# EAGLE design xiaokey (EAGLE 9.6.2)
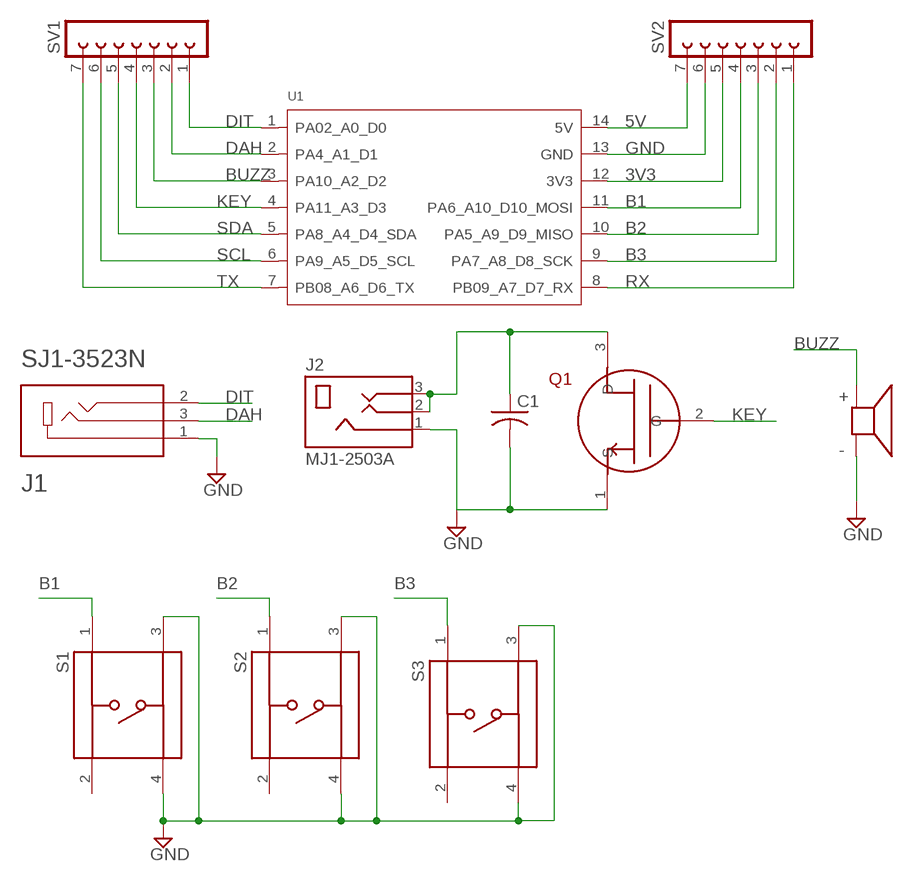
[diagram p0: schematic, sheet 1]

## Parts
C1  C-US050-024X044  [C050-024X044]
J1  SJ1-3523N  [CUI_SJ1-3523N]
J2  MJ1-2503A  [CUI_MJ1-2503A]
LS1  AT-0927-TT-6-R  [XDCR_AT-0927-TT-6-R]
Q1  2N7000  [TO92-LINE]
S1  TS02-66-60-BK-160-LCR-D  [SW_TS02-66-60-BK-160-LCR-D]
S2  TS02-66-60-BK-160-LCR-D  [SW_TS02-66-60-BK-160-LCR-D]
S3  TS02-66-60-BK-160-LCR-D  [SW_TS02-66-60-BK-160-LCR-D]
SV1  FE07-1  [FE07]
SV2  FE07-1  [FE07]
U1  MOUDLE-SEEEDUINO-XIAO  [MOUDLE14P-2.54-21X17.8MM]

## Nets
3V3: SV2.5 U1.12(3V3)
5V: SV2.7 U1.14(5V)
B1: S1.1 SV2.4 U1.11(PA6_A10_D10_MOSI)
B2: S2.1 SV2.3 U1.10(PA5_A9_D9_MISO)
B3: S3.1 SV2.2 U1.9(PA7_A8_D8_SCK)
BUZZ: LS1.P SV1.3 U1.3(PA10_A2_D2)
DAH: J1.3 SV1.2 U1.2(PA4_A1_D1)
DIT: J1.2 SV1.1 U1.1(PA02_A0_D0)
GND: C1.2 J1.1 J2.1 LS1.N Q1.1(S) S1.3 S1.4 S2.3 S2.4 S3.3 S3.4 SV2.6 U1.13(GND)
KEY: Q1.2(G) SV1.4 U1.4(PA11_A3_D3)
N$1: C1.1 J2.2 J2.3 Q1.3(D)
RX: SV2.1 U1.8(PB09_A7_D7_RX)
SCL: SV1.6 U1.6(PA9_A5_D5_SCL)
SDA: SV1.5 U1.5(PA8_A4_D4_SDA)
TX: SV1.7 U1.7(PB08_A6_D6_TX)
Unconnected: S1.2 S2.2 S3.2

## Library data of the parts
C1 = rcl:C-US: CAPACITOR, American symbol; SPICEPREFIX: C
J1 = SJ1-3523N:SJ1-3523N: 3.5 mm Right-Angle Stereo Jack, 3 Pin PCB Mount, Non-Threaded Check availability <https://pricing.snapeda.com/parts/SJ1-3523N/CUI%20Devices/view-part?ref=eda>; AVAILABILITY: In Stock; CUI_PURCHASE_URL: https://www.cuidevices.com/product/interconnect/connectors/audio-connectors/jacks/sj1-352xn-series?utm_source=snapeda.com&utm_medium=referral&utm_campaign=snapedaBOM; DESCRIPTION: 3.5 mm, Stereo, Right Angle, Through Hole, 3 Conductors, 0~2 Internal Switches, Audio Jack Connector; MF: CUI Devices; MP: SJ1-3523N; PACKAGE: None; PRICE: None; PURCHASE-URL: https://pricing.snapeda.com/search/part/SJ1-3523N/?ref=eda
J2 = MJ1-2503A:MJ1-2503A: 2.5 mm, Mono, Right Angle, Through Hole, Audio Jack Connector Check availability <https://pricing.snapeda.com/parts/MJ1-2503A/CUI%20Devices/view-part?ref=eda>; AVAILABILITY: In Stock; CUI_PURCHASE_URL: https://www.cuidevices.com/product/interconnect/connectors/audio-connectors/jacks/mj1-2503a?utm_source=snapeda.com&utm_medium=referral&utm_campaign=snapedaBOM; DESCRIPTION: 2.5 mm, Mono, Right Angle, Through Hole, 2 Conductors, 0 Internal Switches, Audio Jack Connector; MF: CUI Devices; MP: MJ1-2503A; PACKAGE: None; PRICE: None; PURCHASE-URL: https://pricing.snapeda.com/search/part/MJ1-2503A/?ref=eda
LS1 = AT-0927-TT-6-R:AT-0927-TT-6-R: AUDIO TRANSDUCER 85 DB 1.5 V 2730 HZ Check availability <https://pricing.snapeda.com/parts/AT-0927-TT-6-R/PUI%20Audio%2C/view-part?ref=eda>; AVAILABILITY: In Stock; DESCRIPTION: AUDIO TRANSDUCER 85 DB 3 V 2730 HZ; MF: PUI Audio,; MP: AT-0927-TT-6-R; PACKAGE: None; PRICE: None; PURCHASE-URL: https://pricing.snapeda.com/search/part/AT-0927-TT-6-R/?ref=eda
Q1 = 2N7000:2N7000: N-Channel Small Signal MOSFET Check availability <https://pricing.snapeda.com/parts/2N7000/STMicroelectronics/view-part?ref=eda>; AVAILABILITY: In Stock; DESCRIPTION: N-Channel 60 V 350mA (Tc) 1W (Tc) Through Hole TO-92-3; MF: STMicroelectronics; MP: 2N7000; PACKAGE: TO-92 STMicroelectronics; PRICE: None
S1-S3 = TS02-66-60-BK-160-LCR-D:TS02-66-60-BK-160-LCR-D: Check availability <https://pricing.snapeda.com/parts/TS02-66-60-BK-160-LCR-D/CUI%20Devices/view-part?ref=eda>; AVAILABILITY: In Stock; CUI_PURCHASE_URL: https://www.cuidevices.com/product/switches/tactile-switches/ts02-series?utm_source=snapeda.com&utm_medium=referral&utm_campaign=snapedaBOM; DESCRIPTION: 6 x 6 mm, 6 mm Actuator Height, 160 gf, Black, Long Crimped, Through Hole, SPST, Tactile Switch; MF: CUI Devices; MP: TS02-66-60-BK-160-LCR-D; PACKAGE: None; PRICE: None; PURCHASE-URL: https://pricing.snapeda.com/search/part/TS02-66-60-BK-160-LCR-D/?ref=eda
SV1 SV2 = con-lsta:FE07-1: FEMALE HEADER; OC_FARNELL: unknown; OC_NEWARK: unknown
U1 = Seeeduino XIAO:MOUDLE-SEEEDUINO-XIAO

## Board
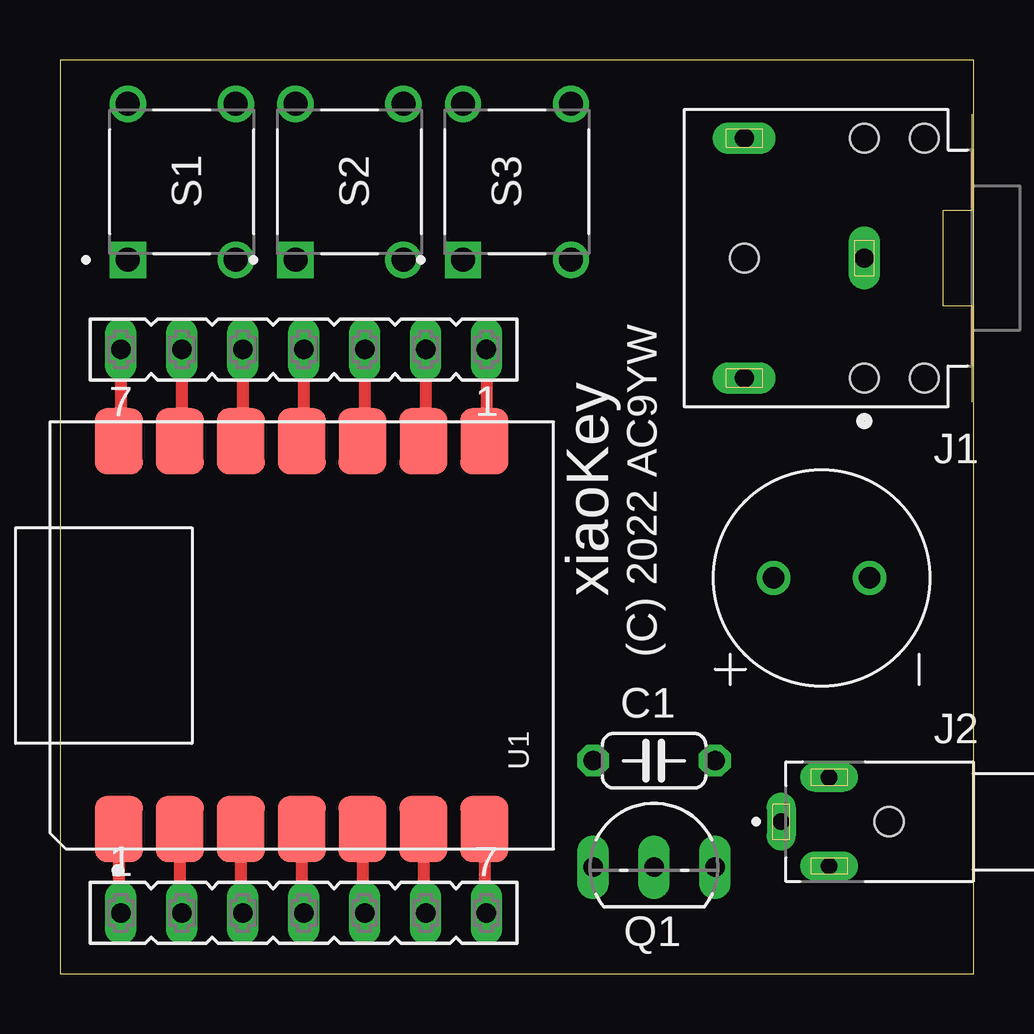
[diagram p1: board, top side]
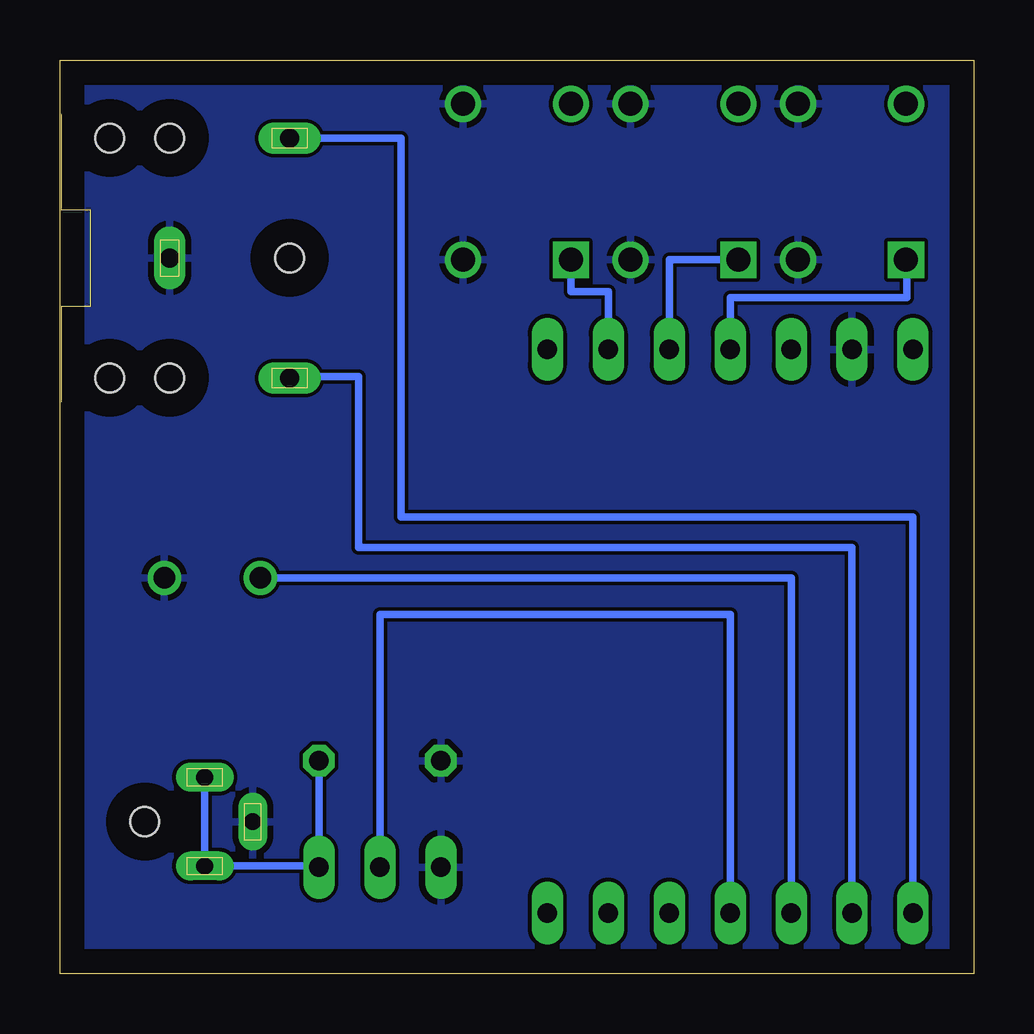
[diagram p2: board, bottom side, seen from below]

Size 38.1 x 38.1 mm. Coordinates in mm from the lower left corner, seen from the top.
Outline: 0,0 38.1,0 38.1,38.1 0,38.1 0,0
Copper layers (1*16): Top 0.035mm / dielectric 1.5mm / Bottom 0.035mm
Design rules "default": minimum track width 6mil, minimum drill 0.35mm, track to track 6mil, track to pad 6mil, pad to pad 6mil, via to via 6mil, smd to smd 6mil, copper to edge 40mil, drill to drill 6mil, minimum pad ring 10mil, minimum via ring 8mil, stop-mask expansion 4mil, vias tented up to drill 0mil, thermal gap 10mil

### Footprints (pad centres in the part's own frame; a part is rotated, then mirrored left to right if it is on the bottom)
C050-024X044 = drill 0.813 octagon: 1 -2.54,0; 2 2.54,0
CUI_SJ1-3523N = drill 0.8 long: 1 0,0; 2 5,-5; 3 5,5 | hole 1.2: -2.5,5; 0,5; 5,0; -2.5,-5; 0,-5
CUI_MJ1-2503A = drill 0.7 long: 1 -4.1,0; 2 -2.1,1.85; 3 -2.1,-1.85 | hole 1.2: 0.4,0
XDCR_AT-0927-TT-6-R = drill 0.9: N 0,-2; P 0,2
TO92-LINE = drill 0.813 long: 1 -2.54,0; 2 0,0; 3 2.54,0
SW_TS02-66-60-BK-160-LCR-D = drill 1 square: 1 -3.25,2.25 | drill 1: 2 3.25,2.25; 3 -3.25,-2.25; 4 3.25,-2.25
FE07 = drill 0.813 long: 1 -7.62,0; 2 -5.08,0; 3 -2.54,0; 4 0,0; 5 2.54,0; 6 5.08,0; 7 7.62,0
MOUDLE14P-2.54-21X17.8MM = smd 2.75 x 2: 1 0.835,18.12; 2 0.835,15.58; 3 0.835,13.04; 4 0.835,10.5; 5 0.835,7.96; 6 0.835,5.42; 7 0.835,2.88; 8 17,2.88; 9 17,5.42; 10 17,7.96; 11 17,10.5; 12 17,13.04; 13 17,15.58; 14 17,18.12

### Placement (x,y rotation side)
C1  24.77,8.89 180 top
J1  33.53,29.84 180 top
J2  34.16,6.35 0 top
LS1  31.75,16.51 90 top
Q1  24.77,4.45 0 top
S1  5.08,33.02 90 top
S2  12.06,33.02 90 top
S3  19.05,33.02 90 top
SV1  10.16,2.54 0 top
SV2  10.16,26.04 180 top
U1  20.57,5.21 90 top

### Tracks (layer width: path | path; a pad name or v marks a point on that pad's centre or on a via)
3V3
  Top 0.508: SV2.5 7.62,22.29 U1.12
5V
  Top 0.508: SV2.7 2.54,22.29 U1.14
B1
  Top 0.508: SV2.4 10.16,22.29 U1.11
  Bottom 0.305: SV2.4 10.16,28.19 2.79,28.19 2.79,29.77 S1.1
B2
  Top 0.508: SV2.3 12.7,22.29 U1.10
  Bottom 0.305: S2.1 12.7,29.77 SV2.3
B3
  Top 0.508: SV2.2 15.24,22.29 U1.9
  Bottom 0.305: S3.1 16.8,28.45 15.24,28.45 SV2.2
BUZZ
  Top 0.508: U1.3 7.53,2.63 SV1.3
  Bottom 0.305: LS1.P 7.62,16.51 SV1.3
DAH
  Top 0.508: U1.2 4.99,2.63 SV1.2
  Bottom 0.305: SV1.2 5.08,17.78 25.65,17.78 25.65,24.89 28.53,24.89 J1.3
DIT
  Top 0.508: U1.1 2.45,2.63 SV1.1
  Bottom 0.305: SV1.1 2.54,19.05 23.88,19.05 23.88,34.84 J1.2
GND
  Top 0.508: SV2.6 5.08,22.29 U1.13
  pour Bottom: 0,0 38.1,0 38.1,38.1 0,38.1
KEY
  Top 0.508: U1.4 10.07,2.63 SV1.4
  Bottom 0.305: SV1.4 10.16,14.99 24.77,14.99 Q1.2
N$1
  Bottom 0.305: J2.2 J2.3 | J2.3 31.75,4.5 | J2.3 27.3,4.5 Q1.3 C1.1
RX
  Top 0.508: SV2.1 17.78,22.29 U1.8
SCL
  Top 0.508: U1.6 15.15,2.63 SV1.6
SDA
  Top 0.508: U1.5 12.61,2.63 SV1.5
TX
  Top 0.508: U1.7 17.69,2.63 SV1.7

### Text on the board
tPlace: xiaoKey | (C) 2022 AC9YW